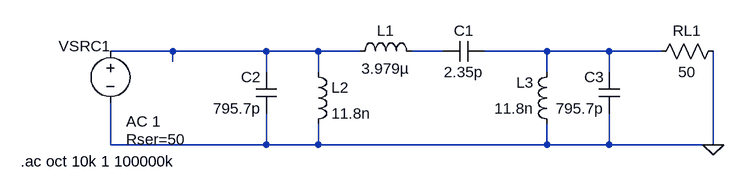
[diagram p0: schematic BPF_3O.asc]
BPF_3O.asc, the LTspice schematic file:
Version 4
SHEET 1 880 680
WIRE 16 96 -80 96
WIRE 160 96 16 96
WIRE 240 96 160 96
WIRE 304 96 240 96
WIRE 432 96 384 96
WIRE 592 96 496 96
WIRE 688 96 592 96
WIRE 768 96 688 96
WIRE 16 112 16 96
WIRE 160 128 160 96
WIRE 240 128 240 96
WIRE 592 128 592 96
WIRE 688 128 688 96
WIRE -80 240 -80 176
WIRE 160 240 160 192
WIRE 160 240 -80 240
WIRE 240 240 240 208
WIRE 240 240 160 240
WIRE 592 240 592 208
WIRE 592 240 240 240
WIRE 688 240 688 192
WIRE 688 240 592 240
WIRE 848 240 848 96
WIRE 848 240 688 240
FLAG 848 240 0
SYMBOL voltage -80 80 R0
WINDOW 0 -80 8 Left 2
WINDOW 123 24 124 Left 2
WINDOW 39 24 152 Left 2
SYMATTR InstName VSRC1
SYMATTR Value ""
SYMATTR Value2 AC 1
SYMATTR SpiceLine Rser=50
SYMBOL res 864 80 R90
WINDOW 0 0 56 VBottom 2
WINDOW 3 32 56 VTop 2
SYMATTR InstName RL1
SYMATTR Value 50
SYMBOL cap 496 80 R90
WINDOW 0 0 32 VBottom 2
WINDOW 3 32 32 VTop 2
SYMATTR InstName C1
SYMATTR Value 2.35p
SYMBOL cap 176 192 R180
WINDOW 0 24 56 Left 2
WINDOW 3 24 8 Left 2
SYMATTR InstName C2
SYMATTR Value 795.7p
SYMBOL cap 704 192 R180
WINDOW 0 24 56 Left 2
WINDOW 3 24 8 Left 2
SYMATTR InstName C3
SYMATTR Value 795.7p
SYMBOL ind 288 112 R270
WINDOW 0 32 56 VTop 2
WINDOW 3 5 56 VBottom 2
SYMATTR InstName L1
SYMATTR Value 3.979µ
SYMBOL ind 224 112 R0
SYMATTR InstName L2
SYMATTR Value 11.8n
SYMBOL ind 608 224 R180
WINDOW 0 36 80 Left 2
WINDOW 3 36 40 Left 2
SYMATTR InstName L3
SYMATTR Value 11.8n
TEXT -218 266 Left 2 !.ac oct 10k 1 100000k

The netlist it stands for:
* BPF_3O.asc
VSRC1 N001 0 AC 1 Rser=50
RL1 0 N003 50
C1 N003 N002 2.35p
C2 0 N001 795.7p
C3 0 N003 795.7p
L1 N001 N002 3.979µ
L2 N001 0 11.8n
L3 0 N003 11.8n
.ac oct 10k 1 100000k
.backanno
.end